# Altium project PCB_Project.PrjPcb
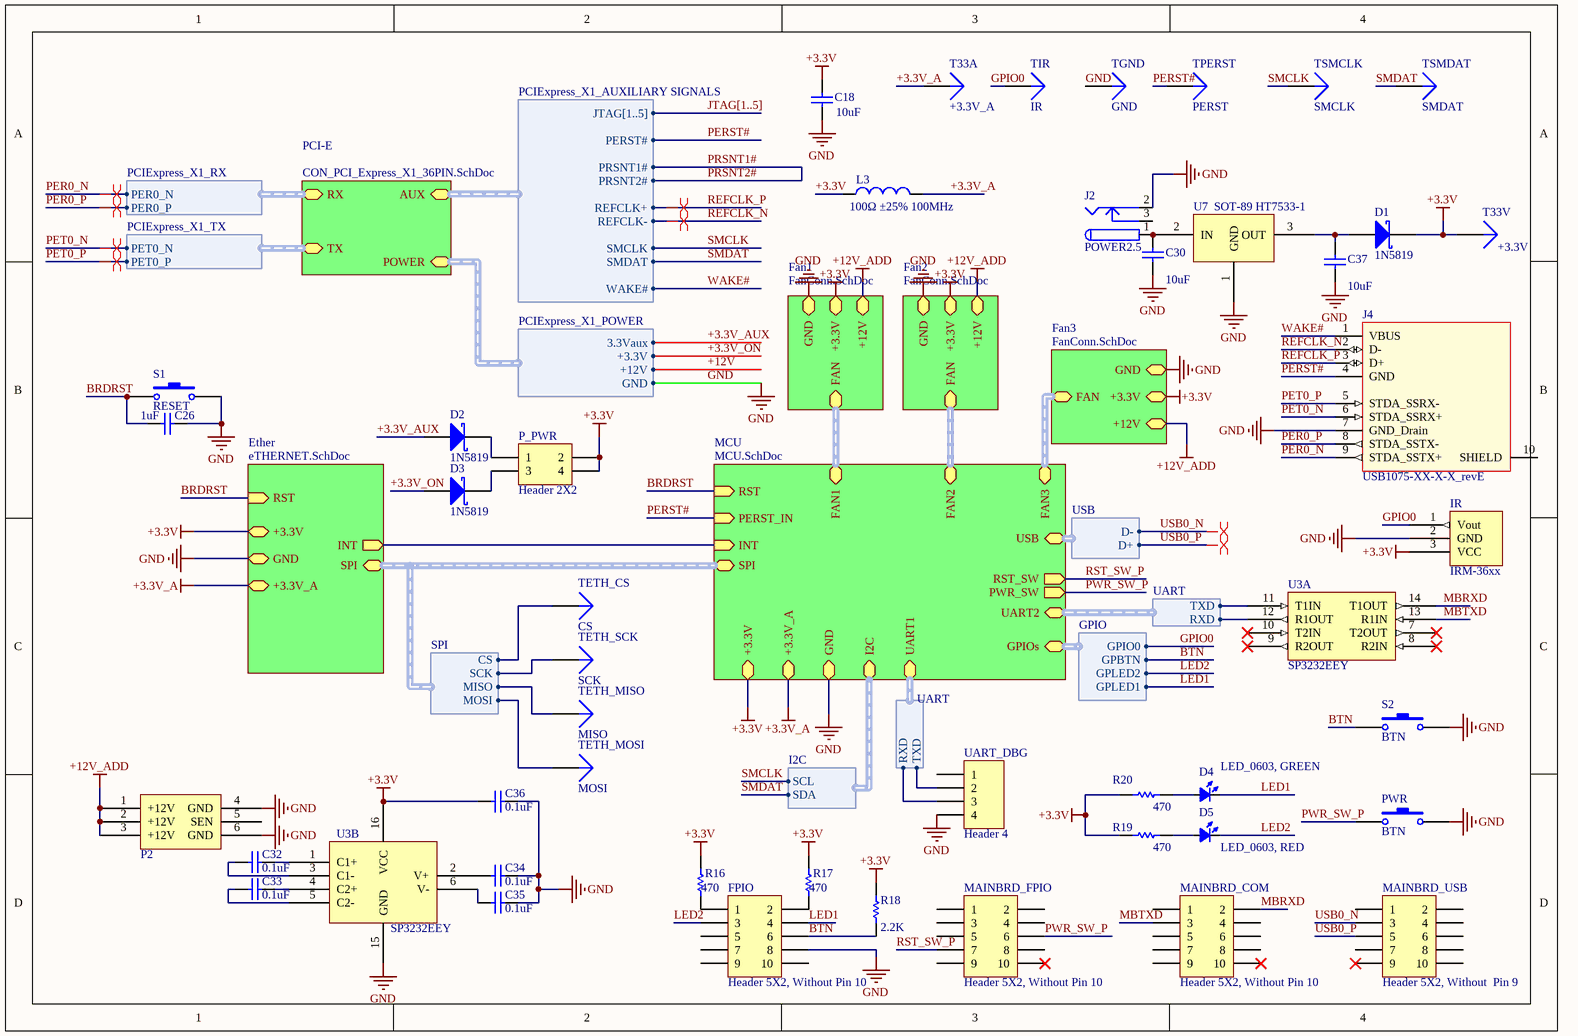
[diagram p0: PCI Express_16765X6890_36PIN_Half length.schdoc]
6 sheets, 108 parts. Net scope: strictly hierarchical (ports join the sheet entries above them; power ports are local).
Board file: PCI Express_16765X11115_36PIN_Half length.PCBDOC
Sheets:
  Sheet1.SchDoc
  PCI Express_16765X6890_36PIN_Half length.schdoc
    PCI-E = CON_PCI_Express_X1_36PIN.SchDoc
    Ether = eTHERNET.SchDoc
    MCU = MCU.SchDoc
    Fan1 = FanConn.SchDoc
    Fan2 = FanConn.SchDoc
    Fan3 = FanConn.SchDoc

## Sheet Sheet1.SchDoc
size A4

## Sheet PCI Express_16765X6890_36PIN_Half length.schdoc
size A4

### Parts
C18  value 10uF  [C-1608[0603]]
C26  value 1uF  [C-1608[0603]]  (hidden comment: Cap Semi)
C30  value 10uF  [C-1608[0603]]
C32  value 0.1uF  [C-1608[0603]]
C33  value 0.1uF  [C-1608[0603]]
C34  value 0.1uF  [C-1608[0603]]
C35  value 0.1uF  [C-1608[0603]]
C36  value 0.1uF  [C-1608[0603]]
C37  value 10uF  [C-1608[0603]]
D1  1N5819  [SOD123]
D2  1N5819  [SOD123]
D3  1N5819  [SOD123]
D4  LED_0603, GREEN  [LED_0603_GREEN]
D5  LED_0603, RED  [LED_0603_RED]
FPIO  Header 5X2, Without Pin 10  [HDR2X5-10]
IR  IRM-36xx  [IRM-36xx]
J2  POWER2.5  [DC_POWER]
J4  USB1075-XX-X-X_revE  [USB1075-XX-X-X_revE]
L3  value 100Ω ±25% 100MHz  [L-1608[0603]]
MAINBRD_COM  Header 5X2, Without Pin 10  [HDR2X5-10]
MAINBRD_FPIO  Header 5X2, Without Pin 10  [HDR2X5-10]
MAINBRD_USB  Header 5X2, Without  Pin 9  [HDR2X5-9]
P2  PCI-E Aux Power Connector 6Pin  [PCIE_AUX_PWR_CONN_6P]  (value not drawn)
P_PWR  Header 2X2  [HDR2X2]
PWR  BTN  [SW-SIDE]
R16  value 470  [R-1608[0603]]
R17  value 470  [R-1608[0603]]
R18  value 2.2K  [R-1608[0603]]
R19  value 470  [R-1608[0603]]
R20  value 470  [R-1608[0603]]
S1  RESET  [SW-2pin-SMD]
S2  BTN  [SW-SIDE]
T33A  +3.3V_A  [TESTPOINT]
T33V  +3.3V  [TESTPOINT]
TETH_CS  CS  [TESTPOINT]
TETH_MISO  MISO  [TESTPOINT]
TETH_MOSI  MOSI  [TESTPOINT]
TETH_SCK  SCK  [TESTPOINT]
TGND  GND  [TESTPOINT]
TIR  IR  [TESTPOINT]
TPERST  PERST  [TESTPOINT]
TSMCLK  SMCLK  [TESTPOINT]
TSMDAT  SMDAT  [TESTPOINT]
U3  SP3232EEY  [LC-TSSOP-16]  (parts A,B of 2)
U7  SOT-89 HT7533-1  [SOT89]
UART_DBG  Header 4  [HDR1X4]

### Sub-sheets
Ether = eTHERNET.SchDoc: +3.3V, GND, +3.3V_A, RST (in), INT (out), SPI (harness SPI)
Fan1 = FanConn.SchDoc: GND, +3.3V, FAN (harness FAN), +12V
Fan2 = FanConn.SchDoc: GND, +3.3V, FAN (harness FAN), +12V
Fan3 = FanConn.SchDoc: GND, +3.3V, FAN (harness FAN), +12V
MCU = MCU.SchDoc: RST (in), +3.3V, GND, SPI (harness SPI), UART1 (harness UART), INT (in), UART2 (harness UART), +3.3V_A, FAN2 (harness FAN), FAN1 (harness FAN), FAN3 (harness FAN), USB (harness USB), I2C (harness I2C), PERST_IN (in), PWR_SW (out), RST_SW (out), GPIOs (harness GPIO)
PCI-E = CON_PCI_Express_X1_36PIN.SchDoc: TX (harness PCIExpress_X1_TX), AUX (harness PCIExpress_X1_AUXILIARY SIGNALS), POWER (harness PCIExpress_X1_POWER), RX (harness PCIExpress_X1_RX)

### Harnesses
PCIExpress_X1_RX: PER0_N, PER0_P
PCIExpress_X1_TX: PET0_N, PET0_P
PCIExpress_X1_POWER: +3.3V, +12V, GND, 3.3Vaux
PCIExpress_X1_AUXILIARY SIGNALS: JTAG[1..5], PERST#, PRSNT1#, PRSNT2#, REFCLK+, REFCLK-, SMCLK, SMDAT, WAKE#
I2C: SCL, SDA
GPIO: GPLED1, GPLED2, GPBTN, GPIO0
USB: D+, D-
UART: TXD, RXD
SPI: MOSI, MISO, SCK, CS

### Nets
+3.3V: C18.2 C36.2 D1.2(K) IR.3(VCC) L3.1 P_PWR.2 P_PWR.4 R16.2 R17.2 R18.2 R19.2 R20.2 T33V.1 U3.16(VCC) ; sheet Ether/+3.3V, sheet MCU/+3.3V, sheet Fan1/+3.3V, sheet Fan2/+3.3V, sheet Fan3/+3.3V
+3.3V_A: L3.2 T33A.1 ; sheet Ether/+3.3V_A, sheet MCU/+3.3V_A
+12V_ADD: P2.1(+12V) P2.2(+12V) P2.3(+12V) ; sheet Fan1/+12V, sheet Fan2/+12V, sheet Fan3/+12V  [project net +12V]
GND: C18.1 C26.2 C30.1 C34.1 C35.1 C36.1 C37.1 FPIO.8 IR.2(GND) J2.2 J4.7(GND_Drain) P2.4(GND) P2.6(GND) PWR.2 S1.2 S2.2 TGND.1 U3.15(GND) U7.1(GND) UART_DBG.4 ; sheet Ether/GND, sheet MCU/GND, sheet Fan1/GND, sheet Fan2/GND, sheet Fan3/GND, sheet PCI-E/POWER.GND
+3.3V_AUX: D2.1(A) ; sheet PCI-E/POWER.3.3Vaux
+3.3V_ON: D3.1(A) ; sheet PCI-E/POWER.+3.3V
BRDRST: C26.1 S1.1 ; sheet Ether/RST, sheet MCU/RST
BTN: FPIO.6 R18.1 S2.1 ; sheet MCU/GPIOs.GPBTN
ETH_INT: sheet Ether/INT, sheet MCU/INT
ETH_MISO: TETH_MISO.1 ; sheet Ether/SPI.MISO
ETH_MOSI: TETH_MOSI.1 ; sheet Ether/SPI.MOSI
ETH_SCK: TETH_SCK.1 ; sheet Ether/SPI.SCK
ETH_SCS: TETH_CS.1 ; sheet Ether/SPI.CS
GPIO0: IR.1(Vout) TIR.1 ; sheet MCU/GPIOs.GPIO0
LED1: D4.2(K) FPIO.4 ; sheet MCU/GPIOs.GPLED1  [project net LED+]
LED2: D5.2(K) FPIO.3 ; sheet MCU/GPIOs.GPLED2  [project net LED-]
MBRXD: MAINBRD_COM.2 U3.14(T1OUT)
MBTXD: MAINBRD_COM.3 U3.13(R1IN)
PER0_N: J4.9(STDA_SSTX+) ; sheet PCI-E/RX.PER0_N
PER0_P: J4.8(STDA_SSTX-) ; sheet PCI-E/RX.PER0_P
PERST#: J4.4(GND) TPERST.1 ; sheet MCU/PERST_IN, sheet PCI-E/AUX.PERST#  [project net PERST]
PET0_N: J4.6(STDA_SSRX+) ; sheet PCI-E/TX.PET0_N
PET0_P: J4.5(STDA_SSRX-) ; sheet PCI-E/TX.PET0_P
PRSNT1#: sheet PCI-E/AUX.PRSNT1#, sheet PCI-E/AUX.PRSNT2#  [also labelled PRSNT2#]
PWR_SW_P: MAINBRD_FPIO.6 PWR.1 ; sheet MCU/PWR_SW
REFCLK_N: J4.2(D-) ; sheet PCI-E/AUX.REFCLK-
REFCLK_P: J4.3(D+) ; sheet PCI-E/AUX.REFCLK+
RST_SW_P: MAINBRD_FPIO.7 ; sheet MCU/RST_SW
RXD1: UART_DBG.3 ; sheet MCU/UART1.RXD
RXD2: U3.12(R1OUT) ; sheet MCU/UART2.RXD
SMCLK: TSMCLK.1 ; sheet PCI-E/AUX.SMCLK, sheet MCU/I2C.SCL  [project net I2C_SCL]
SMDAT: TSMDAT.1 ; sheet PCI-E/AUX.SMDAT, sheet MCU/I2C.SDA  [project net I2C_SDA]
TXD1: UART_DBG.2 ; sheet MCU/UART1.TXD
TXD2: U3.11(T1IN) ; sheet MCU/UART2.TXD
USB0_N: MAINBRD_USB.3 ; sheet MCU/USB.D-
USB0_P: MAINBRD_USB.5 ; sheet MCU/USB.D+
WAKE#: J4.1(VBUS) ; sheet PCI-E/AUX.WAKE#
NetC30_2: C30.2 J2.1 U7.2(IN)
NetC32_1: C32.1 U3.1(C1+)
NetC32_2: C32.2 U3.3(C1-)
NetC33_1: C33.1 U3.4(C2+)
NetC33_2: C33.2 U3.5(C2-)
NetC34_2: C34.2 U3.2(V+)
NetC35_2: C35.2 U3.6(V-)
NetC37_2: C37.2 D1.1(A) U7.3(OUT)
NetD2_2: D2.2(K) P_PWR.1
NetD3_2: D3.2(K) P_PWR.3
NetD4_1: D4.1(A) R20.1
NetD5_1: D5.1(A) R19.1
NetFPIO_1: FPIO.1 R16.1
NetFPIO_2: FPIO.2 R17.1

Not connected (* = marked no-connect by the designer): FPIO 5 7 9 10; J2 3; J4 10(SHIELD); MAINBRD_COM 1 4 5 6 7 8 9 10*; MAINBRD_FPIO 1 2 3 4 5 8 9 10*; MAINBRD_USB 1 2 4 6 7 8 9* 10; P2 5(SEN); U3 7(T2OUT)* 8(R2IN)* 9(R2OUT)* 10(T2IN)*; UART_DBG 1

### Buses and harness runs
bus JTAG[1..5]
harness sheet Ether/SPI = sheet MCU/SPI
harness sheet Fan1/FAN = sheet MCU/FAN1
harness sheet Fan2/FAN = sheet MCU/FAN2
harness sheet Fan3/FAN = sheet MCU/FAN3

### Layout directives
differential pair: PER0_N, PER0_P, PET0_N, PET0_P, REFCLK_N, REFCLK_P, USB0_N, USB0_P

### Notes on the sheet
- Title
- Size:
- Date:
- A4
- Number:
- Time:
- Revision:
- Sheet
- of
- File:

### Library data of the parts
C18 C26 C30 C32-C37 = Cap Semi: Capacitor (Semiconductor SIM Model); Published: 8-Jun-2000; LatestRevisionDate: 29-May-2009; LatestRevisionNote: IPC-7351 Footprint Added.; PackageReference: C1206; Publisher: Altium Limited; PackageDescription: Chip Capacitor
D1-D3 = D Schottky: Schottky Diode; Published: 8-Jun-2000; LatestRevisionDate: 17-Jul-2002; LatestRevisionNote: Re-released for DXP Platform.; PackageReference: SMB; Publisher: Altium Limited; PackageDescription: DO-214-AA/SMB; 2 C-Bend Leads; Body 5.3 x 3.6 mm, inc. leads (LxW); Code_JEDEC: DO-214-AA
D4 D5 = LED_0603: LED
FPIO MAINBRD_COM MAINBRD_FPIO MAINBRD_USB = Header 5X2: Header, 5-Pin, Dual row; LatestRevisionDate: 17-Jul-2002; LatestRevisionNote: Re-released for DXP Platform.; Publisher: Altium Limited
J4 = USB1075-XX-X-X_revE: USB 3.0 Receptecal, Type A, 9 Pin, Through Hole, Horizontal, Top Mount, with Kinked Shell Stakes
L3 = Inductor: Code_IEC: 1005; Published: 8-Jun-2000; LatestRevisionDate: 29-May-2009; LatestRevisionNote: IPC-7351 Footprint Added.; PackageReference: 0402-A; Publisher: Altium Limited; PackageDescription: Chip Inductor; Code_JEITA: 0402
P_PWR = Header 2X2: Header, 2-Pin, Dual row; LatestRevisionDate: 17-Jul-2002; LatestRevisionNote: Re-released for DXP Platform.; Publisher: Altium Limited
PWR S1 S2 = SW-PB: Switch; Published: 24-Mar-1999; LatestRevisionDate: 17-Jul-2002; LatestRevisionNote: Re-released for DXP Platform.; PackageReference: SPST-2; Publisher: Altium Limited
R16-R20 = Res Semi: Semiconductor Resistor; Published: 8-Jun-2000; LatestRevisionDate: 17-Jul-2002; LatestRevisionNote: Re-released for DXP Platform.; PackageReference: AXIAL-0.5; Publisher: Altium Limited; PackageDescription: Axial Device, Thru-Hole; 2 Leads; 0.5 in Pin Spacing
T33A T33V TETH_CS TETH_MISO TETH_MOSI TETH_SCK TGND TIR TPERST TSMCLK TSMDAT = Plug: LatestRevisionDate: 17-Jul-2002; LatestRevisionNote: Re-released for DXP Platform.; Publisher: Altium Limited
U7 = HT73XX: Low Power Consumption LDO
UART_DBG = Header 4: Header, 4-Pin; LatestRevisionDate: 17-Jul-2002; LatestRevisionNote: Re-released for DXP Platform.; Publisher: Altium Limited

## Sheet CON_PCI_Express_X1_36PIN.SchDoc: PCI Express x1 36Pin
size A4
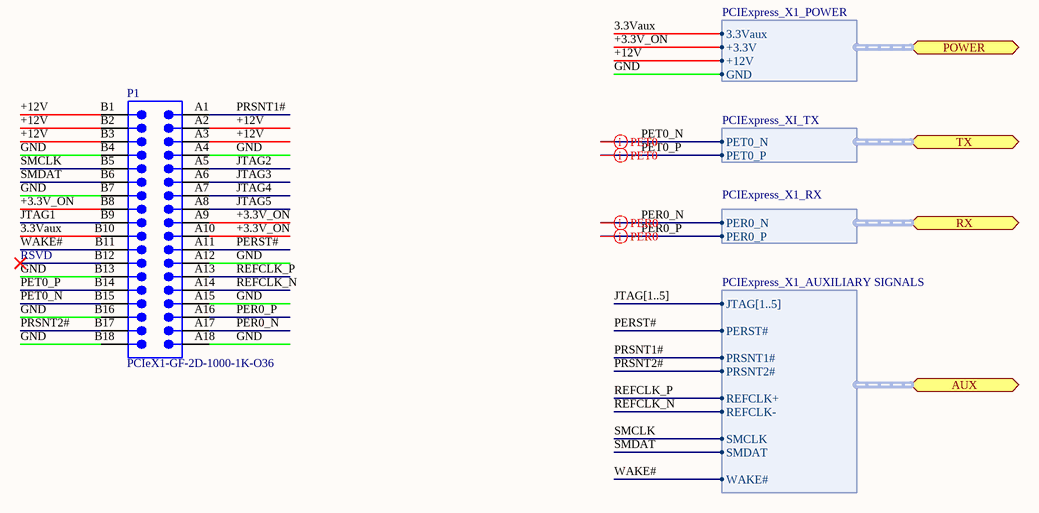
[diagram p1: CON_PCI_Express_X1_36PIN.SchDoc]

### Parts
P1  PCIeX1-GF-2D-1000-1K-O36  [PCIeX1-GF-2D-1000-1K-O36]  (no BOM)

### Ports
AUX (harness PCIExpress_X1_AUXILIARY SIGNALS), POWER (harness PCIExpress_X1_POWER), RX (harness PCIExpress_X1_RX), TX (harness PCIExpress_XI_TX)

### Harnesses
PCIExpress_X1_RX: PER0_N, PER0_P
PCIExpress_XI_TX: PET0_N, PET0_P
PCIExpress_X1_POWER: +3.3V, +12V, GND, 3.3Vaux
PCIExpress_X1_AUXILIARY SIGNALS: JTAG[1..5], PERST#, PRSNT1#, PRSNT2#, REFCLK+, REFCLK-, SMCLK, SMDAT, WAKE#

### Nets
GND: P1.A4 P1.A12 P1.A15 P1.A18 P1.B4 P1.B7 P1.B13 P1.B16 P1.B18 ; port POWER.GND
3.3Vaux: P1.B10 ; port POWER.3.3Vaux  [project net +3.3V_AUX]
+3.3V_ON: P1.A9 P1.A10 P1.B8 ; port POWER.+3.3V
+12V: P1.A2 P1.A3 P1.B1 P1.B2 P1.B3 ; port POWER.+12V
JTAG1: P1.B9
JTAG2: P1.A5
JTAG3: P1.A6
JTAG4: P1.A7
JTAG5: P1.A8
PER0_N: P1.A17 ; port RX.PER0_N
PER0_P: P1.A16 ; port RX.PER0_P
PERST#: P1.A11 ; port AUX.PERST#  [project net PERST]
PET0_N: P1.B15 ; port TX.PET0_N
PET0_P: P1.B14 ; port TX.PET0_P
PRSNT1#: P1.A1 P1.B17 ; port AUX.PRSNT1#, port AUX.PRSNT2#  [also labelled PRSNT2#]
REFCLK_N: P1.A14 ; port AUX.REFCLK-
REFCLK_P: P1.A13 ; port AUX.REFCLK+
SMCLK: P1.B5 ; port AUX.SMCLK  [project net I2C_SCL]
SMDAT: P1.B6 ; port AUX.SMDAT  [project net I2C_SDA]
WAKE#: P1.B11 ; port AUX.WAKE#

Not connected (* = marked no-connect by the designer): P1 B12*

### Buses and harness runs
bus JTAG[1..5]

### Layout directives
differential pair: PER0_N, PER0_P, PET0_N, PET0_P

### Notes on the sheet
- RSVD
- Sheet Title
- Project Title
- Size:
- Date:
- A4
- Item:
- Time:
- Revision:
- Sheet
- of
- File:

### Library data of the parts
P1 = CMP-0001-00030-2: Golden finger, PCIeX1, Dual, Opposite, Pitch 1mm, 36-Position; Mating Connector: Molex-87715-9006; Package Reference: PCIeX1-GF-2D-1000-1K-O36; ClassName: Edge Connector; Publisher: Altium; Datasheet Version: rev2.0, Apr-2007

## Sheet eTHERNET.SchDoc
size A4
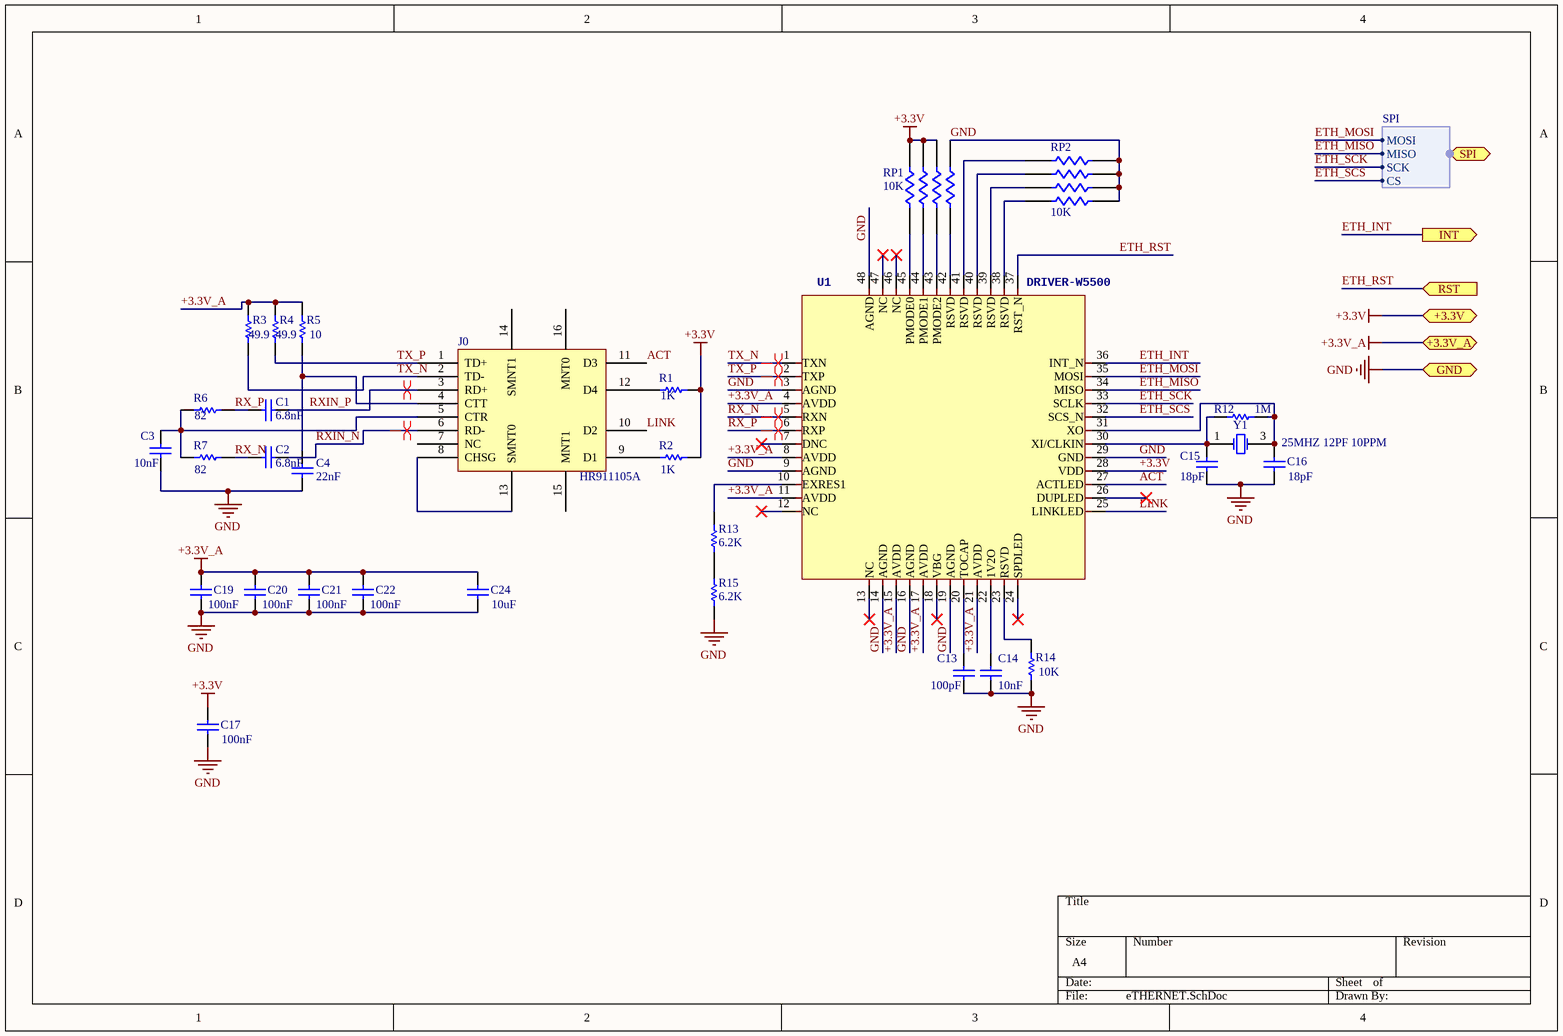
[diagram p2: eTHERNET.SchDoc]

### Parts
C1  value 6.8nF  [C-1608[0603]]
C2  value 6.8nF  [C-1608[0603]]
C3  value 10nF  [C-1608[0603]]
C4  value 22nF  [C-1608[0603]]
C13  value 100pF  [C-1608[0603]]
C14  value 10nF  [C-1608[0603]]
C15  value 18pF  [C-1608[0603]]
C16  value 18pF  [C-1608[0603]]
C17  value 100nF  [C-1608[0603]]
C19  value 100nF  [C-1608[0603]]
C20  value 100nF  [C-1608[0603]]
C21  value 100nF  [C-1608[0603]]
C22  value 100nF  [C-1608[0603]]
C24  value 10uF  [C-1608[0603]]
J0  HR911105A  [RJ45-8P8C]
R1  value 1K  [R-1608[0603]]
R2  value 1K  [R-1608[0603]]
R3  value 49.9  [R-1608[0603]]
R4  value 49.9  [R-1608[0603]]
R5  value 10  [R-1608[0603]]
R6  value 82  [R-1608[0603]]
R7  value 82  [R-1608[0603]]
R12  value 1M  [R-1608[0603]]
R13  value 6.2K  [R-1608[0603]]
R14  value 10K  [R-1608[0603]]
R15  value 6.2K  [R-1608[0603]]
RP1  10K  [R0603x4]
RP2  10K  [R0603x4]
U1  DRIVER-W5500  [TQFP48_N]
Y1  25MHZ 12PF 10PPM  [XT_3225_4]

### Ports
+3.3V, +3.3V_A, GND, INT (out), RST (in), SPI (harness SPI)

### Harnesses
SPI: MOSI, MISO, SCK, CS

### Nets
+3.3V: C17.2 R1.2 R2.2 RP1.6 RP1.7 RP1.8 U1.28(VDD) ; port +3.3V
+3.3V_A: C19.2 C20.2 C21.2 C22.2 C24.2 R3.2 R4.2 R5.2 U1.4(AVDD) U1.8(AVDD) U1.11(AVDD) U1.15(AVDD) U1.17(AVDD) U1.21(AVDD) ; port +3.3V_A
GND: C3.1 C4.1 C13.1 C14.1 C15.1 C16.1 C17.1 C19.1 C20.1 C21.1 C22.1 C24.1 R14.2 R15.2 RP1.5 RP2.5 RP2.6 RP2.7 RP2.8 U1.3(AGND) U1.9(AGND) U1.14(AGND) U1.16(AGND) U1.19(AGND) U1.29(GND) U1.48(AGND) ; port GND
ACT: J0.11(D3) U1.27(ACTLED)
ETH_INT: U1.36(INT_N) ; port INT
ETH_MISO: U1.34(MISO) ; port SPI.MISO
ETH_MOSI: U1.35(MOSI) ; port SPI.MOSI
ETH_RST: U1.37(RST_N) ; port RST  [project net BRDRST]
ETH_SCK: U1.33(SCLK) ; port SPI.SCK
ETH_SCS: U1.32(SCS_N) ; port SPI.CS
LINK: J0.10(D2) U1.25(LINKLED)
RX_N: C2.1 R7.2 U1.5(RXN)
RX_P: C1.1 R6.2 U1.6(RXP)
RXIN_N: C2.2 J0.6(RD-)
RXIN_P: C1.2 J0.3(RD+)
TX_N: J0.2(TD-) R3.1 U1.1(TXN)
TX_P: J0.1(TD+) R4.1 U1.2(TXP)
NetC3_2: C3.2 J0.5(CTR) R6.1 R7.1
NetC4_2: C4.2 J0.4(CTT) R5.1
NetC13_2: C13.2 U1.20(TOCAP)
NetC14_2: C14.2 U1.22(1V2O)
NetC15_2: C15.2 R12.1 U1.30(XI/CLKIN) Y1.1(OSC1)
NetC16_2: C16.2 R12.2 U1.31(XO) Y1.3(OSC2)
NetJ0_8: J0.8(CHSG) J0.13(SMNT0)
NetJ0_9: J0.9(D1) R2.1
NetJ0_12: J0.12(D4) R1.1
NetR13_1: R13.1 U1.10(EXRES1)
NetR13_2: R13.2 R15.1
NetR14_1: R14.1 U1.23(RSVD)
NetRP1_1: RP1.1 U1.45(PMODE0)
NetRP1_2: RP1.2 U1.44(PMODE1)
NetRP1_3: RP1.3 U1.43(PMODE2)
NetRP1_4: RP1.4 U1.42(RSVD)
NetRP2_1: RP2.1 U1.41(RSVD)
NetRP2_2: RP2.2 U1.40(RSVD)
NetRP2_3: RP2.3 U1.39(RSVD)
NetRP2_4: RP2.4 U1.38(RSVD)

Not connected (* = marked no-connect by the designer): J0 7(NC) 14(SMNT1) 15(MNT1) 16(MNT0); U1 7(DNC)* 12(NC)* 13(NC)* 18(VBG)* 24(SPDLED)* 26(DUPLED)* 46(NC)* 47(NC)*

### Layout directives
differential pair: RX_N, RX_P, RXIN_N, RXIN_P, TX_N, TX_P

### Library data of the parts
C1-C4 C13-C17 C19-C22 C24 = Cap Semi: Capacitor (Semiconductor SIM Model); Published: 8-Jun-2000; LatestRevisionDate: 29-May-2009; LatestRevisionNote: IPC-7351 Footprint Added.; Publisher: Altium Limited; PackageDescription: Chip Capacitor
  C1-C4 C14-C17 C19-C22 C24: PackageReference: C1206
  C13: PackageReference: 4.7uF
J0 = RJ45INTLED
R1-R7 R12-R15 = Res Semi: Semiconductor Resistor; Published: 8-Jun-2000; LatestRevisionDate: 17-Jul-2002; LatestRevisionNote: Re-released for DXP Platform.; PackageReference: AXIAL-0.5; Publisher: Altium Limited
  R1-R7 R12 R14: PackageDescription: Axial Device, Thru-Hole; 2 Leads; 0.5 in Pin Spacing
RP1 RP2 = RPACK4
Y1 = XTAL: Crystal Oscillator; Published: 8-Jun-2000; LatestRevisionDate: 17-Jul-2002; LatestRevisionNote: Re-released for DXP Platform.; PackageReference: R38; Publisher: Altium Limited; PackageDescription: Crystal, Thru-Hole; 2 Leads; Body 3.1 x 8.2 mm (Dia.xH)

## Sheet MCU.SchDoc
size A4
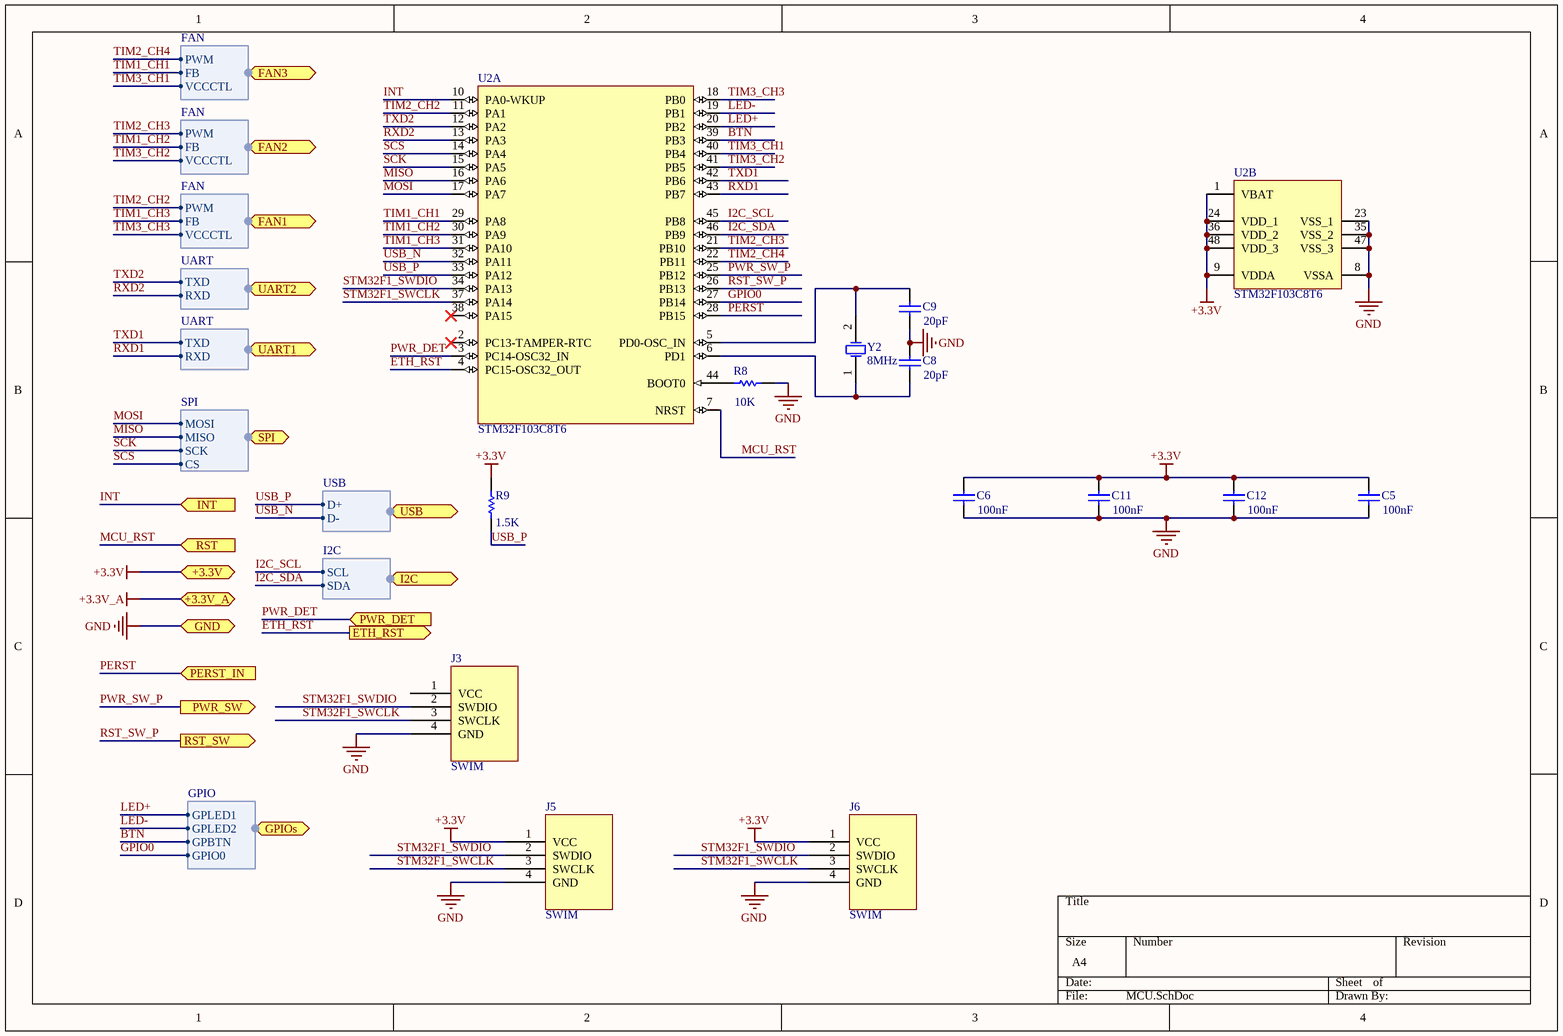
[diagram p3: MCU.SchDoc]

### Parts
C5  value 100nF  [C-1608[0603]]
C6  value 100nF  [C-1608[0603]]
C8  value 20pF  [C-1608[0603]]
C9  value 20pF  [C-1608[0603]]
C11  value 100nF  [C-1608[0603]]
C12  value 100nF  [C-1608[0603]]
J3  SWIM  [SIP4]
J5  SWIM  [SWD_SOCKET]
J6  SWIM  [SWD_HEADER]
R8  value 10K  [R-1608[0603]]
R9  value 1.5K  [R-1608[0603]]
U2  STM32F103C8T6  [TQFP48_N]  (parts A,B of 2)
Y2  8MHz  [LC-SMD-5032_2P]

### Ports
+3.3V, +3.3V_A, ETH_RST (out), FAN1 (harness FAN), FAN2 (harness FAN), FAN3 (harness FAN), GND, GPIOs (harness GPIO), I2C (harness I2C), INT (in), PERST_IN (in), PWR_DET (in), PWR_SW (out), RST (in), RST_SW (out), SPI (harness SPI), UART1 (harness UART), UART2 (harness UART), USB (harness USB)

### Harnesses
SPI: MOSI, MISO, SCK, CS
UART: TXD, RXD
USB: D+, D-
I2C: SCL, SDA
GPIO: GPLED1, GPLED2, GPBTN, GPIO0
FAN: PWM, FB, VCCCTL

### Nets
+3.3V: C5.2 C6.2 C11.2 C12.2 J5.1(VCC) J6.1(VCC) R9.2 U2.1(VBAT) U2.9(VDDA) U2.24(VDD_1) U2.36(VDD_2) U2.48(VDD_3) ; port +3.3V
GND: C5.1 C6.1 C8.2 C9.1 C11.1 C12.1 J3.4(GND) J5.4(GND) J6.4(GND) R8.2 U2.8(VSSA) U2.23(VSS_1) U2.35(VSS_2) U2.47(VSS_3) ; port GND
BTN: U2.39(PB3) ; port GPIOs.GPBTN
ETH_RST: U2.4(PC15-OSC32_OUT) ; port ETH_RST
GPIO0: U2.27(PB14) ; port GPIOs.GPIO0
I2C_SCL: U2.45(PB8) ; port I2C.SCL
I2C_SDA: U2.46(PB9) ; port I2C.SDA
INT: U2.10(PA0-WKUP) ; port INT  [project net ETH_INT]
LED+: U2.20(PB2) ; port GPIOs.GPLED1
LED-: U2.19(PB1) ; port GPIOs.GPLED2
MCU_RST: U2.7(NRST) ; port RST  [project net BRDRST]
MISO: U2.16(PA6) ; port SPI.MISO  [project net ETH_MISO]
MOSI: U2.17(PA7) ; port SPI.MOSI  [project net ETH_MOSI]
PERST: U2.28(PB15) ; port PERST_IN
PWR_DET: U2.3(PC14-OSC32_IN) ; port PWR_DET
PWR_SW_P: U2.25(PB12) ; port PWR_SW
RST_SW_P: U2.26(PB13) ; port RST_SW
RXD1: U2.43(PB7) ; port UART1.RXD
RXD2: U2.13(PA3) ; port UART2.RXD
SCK: U2.15(PA5) ; port SPI.SCK  [project net ETH_SCK]
SCS: U2.14(PA4) ; port SPI.CS  [project net ETH_SCS]
STM32F1_SWCLK: J3.3(SWCLK) J5.3(SWCLK) J6.3(SWCLK) U2.37(PA14)
STM32F1_SWDIO: J3.2(SWDIO) J5.2(SWDIO) J6.2(SWDIO) U2.34(PA13)
TIM1_CH1: U2.29(PA8) ; port FAN3.FB  [project net SEN]
TIM1_CH2: U2.30(PA9) ; port FAN2.FB  [project net SEN]
TIM1_CH3: U2.31(PA10) ; port FAN1.FB  [project net SEN]
TIM2_CH2: U2.11(PA1) ; port FAN1.PWM  [project net PWM]
TIM2_CH3: U2.21(PB10) ; port FAN2.PWM  [project net PWM]
TIM2_CH4: U2.22(PB11) ; port FAN3.PWM  [project net PWM]
TIM3_CH1: U2.40(PB4) ; port FAN3.VCCCTL
TIM3_CH2: U2.41(PB5) ; port FAN2.VCCCTL
TIM3_CH3: U2.18(PB0) ; port FAN1.VCCCTL
TXD1: U2.42(PB6) ; port UART1.TXD
TXD2: U2.12(PA2) ; port UART2.TXD
USB_N: U2.32(PA11) ; port USB.D-  [project net USB0_N]
USB_P: R9.1 U2.33(PA12) ; port USB.D+  [project net USB0_P]
NetC8_1: C8.1 U2.6(PD1) Y2.1(OSC1)
NetC9_2: C9.2 U2.5(PD0-OSC_IN) Y2.2(OSC2)
NetR8_1: R8.1 U2.44(BOOT0)

Not connected (* = marked no-connect by the designer): J3 1(VCC); U2 2(PC13-TAMPER-RTC)* 38(PA15)*

### Library data of the parts
C5 C6 C8 C9 C11 C12 = Cap Semi: Capacitor (Semiconductor SIM Model); Published: 8-Jun-2000; LatestRevisionDate: 29-May-2009; LatestRevisionNote: IPC-7351 Footprint Added.; PackageReference: C1206; Publisher: Altium Limited; PackageDescription: Chip Capacitor
J3 J5 J6 = SWD
R8 R9 = Res Semi: Semiconductor Resistor; Published: 8-Jun-2000; LatestRevisionDate: 17-Jul-2002; LatestRevisionNote: Re-released for DXP Platform.; PackageReference: AXIAL-0.5; Publisher: Altium Limited; PackageDescription: Axial Device, Thru-Hole; 2 Leads; 0.5 in Pin Spacing
U2 = STM32F103C8T6: ARM; ComponentLink1Description: 供应商链接; ComponentLink1URL: http://www.szlcsc.com/product/details_9243.html; Package: LQFP-48_7x7x05P; Supplier: LC; SuppliersPartNumber: C8734
Y2 = XTAL: Crystal Oscillator; Published: 8-Jun-2000; LatestRevisionDate: 17-Jul-2002; LatestRevisionNote: Re-released for DXP Platform.; PackageReference: R38; Publisher: Altium Limited; PackageDescription: Crystal, Thru-Hole; 2 Leads; Body 3.1 x 8.2 mm (Dia.xH)

## Sheet FanConn.SchDoc
size A4
Used 3 times, as channels Fan1, Fan2, Fan3. Parts and nets are listed once, with the designators drawn on the sheet.
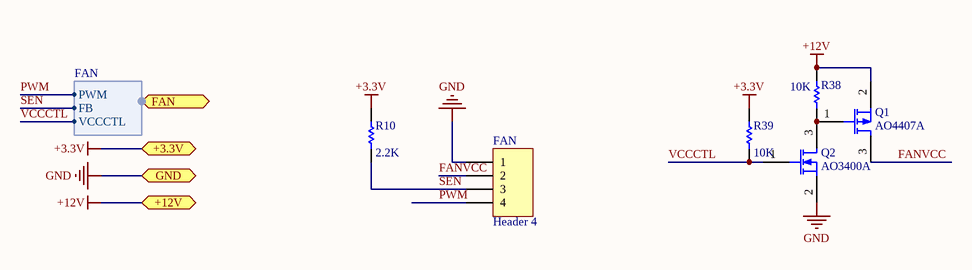
[diagram p4: FanConn.SchDoc]

### Parts
FAN  Header 4  [FAN_CONN-4P]
Q1  AO4407A  [SOP8-MOS]
Q2  AO3400A  [SOT23B]
R10  value 2.2K  [R-1608[0603]]
R38  value 10K  [R-1608[0603]]
R39  value 10K  [R-1608[0603]]

### Ports
+3.3V, +12V, FAN (harness FAN), GND

### Harnesses
FAN: PWM, FB, VCCCTL

### Nets
+3.3V: R10.2 R39.1 ; port +3.3V
+12V: Q1.2(S) R38.1 ; port +12V
GND: FAN.1 Q2.2(S) ; port GND
FANVCC: FAN.2 Q1.3(D)
PWM: FAN.4 ; port FAN.PWM
SEN: FAN.3 R10.1 ; port FAN.FB
VCCCTL: Q2.1(G) R39.2 ; port FAN.VCCCTL
NetQ1_1: Q1.1(G) Q2.3(D) R38.2

### Channels
Fan1: designators end in A; ports +3.3V=+3.3V +12V=+12V GND=GND
Fan2: designators end in B; ports +3.3V=+3.3V +12V=+12V GND=GND
Fan3: designators end in C; ports +3.3V=+3.3V +12V=+12V GND=GND

### Library data of the parts
FAN = Header 4: Header, 4-Pin; LatestRevisionDate: 17-Jul-2002; LatestRevisionNote: Re-released for DXP Platform.; Publisher: Altium Limited
Q1 = SI2301: P-Channel MOSFET; pin to pad: 1>G 2>S 3>D; Published: 8-Jun-2000; LatestRevisionDate: 17-Jul-2002; LatestRevisionNote: Re-released for DXP Platform.; PackageVersion: 1995/1996; PackageReference: E3; Publisher: Altium Limited
Q2 = SI2302: N-Channel MOSFET; Published: 8-Jun-2000; LatestRevisionDate: 17-Jul-2002; LatestRevisionNote: Re-released for DXP Platform.; PackageVersion: 1995/1996; PackageReference: E3; Publisher: Altium Limited
R10 R38 R39 = Res Semi: Semiconductor Resistor; Published: 8-Jun-2000; LatestRevisionDate: 17-Jul-2002; LatestRevisionNote: Re-released for DXP Platform.; PackageReference: AXIAL-0.5; Publisher: Altium Limited; PackageDescription: Axial Device, Thru-Hole; 2 Leads; 0.5 in Pin Spacing

## Nets that join several sheets
+3.3V: PCI Express_16765X6890_36PIN_Half length (14 pins), eTHERNET (7 pins), MCU (12 pins), Fan1 (R10A.2 R39A.1), Fan2 (R10B.2 R39B.1), Fan3 (R10C.2 R39C.1)
+3.3V_A: PCI Express_16765X6890_36PIN_Half length (L3.2 T33A.1), eTHERNET (14 pins)
+12V: PCI Express_16765X6890_36PIN_Half length (P2.1 P2.2 P2.3), Fan1 (Q1A.2 R38A.1), Fan2 (Q1B.2 R38B.1), Fan3 (Q1C.2 R38C.1)
GND: PCI Express_16765X6890_36PIN_Half length (20 pins), CON_PCI_Express_X1_36PIN (9 pins), eTHERNET (26 pins), MCU (14 pins), Fan1 (FANA.1 Q2A.2), Fan2 (FANB.1 Q2B.2), Fan3 (FANC.1 Q2C.2)
+3.3V_AUX: PCI Express_16765X6890_36PIN_Half length (D2.1), CON_PCI_Express_X1_36PIN (P1.B10)
+3.3V_ON: PCI Express_16765X6890_36PIN_Half length (D3.1), CON_PCI_Express_X1_36PIN (P1.A9 P1.A10 P1.B8)
BRDRST: PCI Express_16765X6890_36PIN_Half length (C26.1 S1.1), eTHERNET (U1.37), MCU (U2.7)
BTN: PCI Express_16765X6890_36PIN_Half length (FPIO.6 R18.1 S2.1), MCU (U2.39)
ETH_INT: eTHERNET (U1.36), MCU (U2.10)
ETH_MISO: PCI Express_16765X6890_36PIN_Half length (TETH_MISO.1), eTHERNET (U1.34), MCU (U2.16)
ETH_MOSI: PCI Express_16765X6890_36PIN_Half length (TETH_MOSI.1), eTHERNET (U1.35), MCU (U2.17)
ETH_SCK: PCI Express_16765X6890_36PIN_Half length (TETH_SCK.1), eTHERNET (U1.33), MCU (U2.15)
ETH_SCS: PCI Express_16765X6890_36PIN_Half length (TETH_CS.1), eTHERNET (U1.32), MCU (U2.14)
GPIO0: PCI Express_16765X6890_36PIN_Half length (IR.1 TIR.1), MCU (U2.27)
I2C_SCL: PCI Express_16765X6890_36PIN_Half length (TSMCLK.1), CON_PCI_Express_X1_36PIN (P1.B5), MCU (U2.45)
I2C_SDA: PCI Express_16765X6890_36PIN_Half length (TSMDAT.1), CON_PCI_Express_X1_36PIN (P1.B6), MCU (U2.46)
LED+: PCI Express_16765X6890_36PIN_Half length (D4.2 FPIO.4), MCU (U2.20)
LED-: PCI Express_16765X6890_36PIN_Half length (D5.2 FPIO.3), MCU (U2.19)
PER0_N: PCI Express_16765X6890_36PIN_Half length (J4.9), CON_PCI_Express_X1_36PIN (P1.A17)
PER0_P: PCI Express_16765X6890_36PIN_Half length (J4.8), CON_PCI_Express_X1_36PIN (P1.A16)
PERST: PCI Express_16765X6890_36PIN_Half length (J4.4 TPERST.1), CON_PCI_Express_X1_36PIN (P1.A11), MCU (U2.28)
PET0_N: PCI Express_16765X6890_36PIN_Half length (J4.6), CON_PCI_Express_X1_36PIN (P1.B15)
PET0_P: PCI Express_16765X6890_36PIN_Half length (J4.5), CON_PCI_Express_X1_36PIN (P1.B14)
PWM: MCU (U2.11), Fan1 (FANA.4)
PWM: MCU (U2.21), Fan2 (FANB.4)
PWM: MCU (U2.22), Fan3 (FANC.4)
PWR_SW_P: PCI Express_16765X6890_36PIN_Half length (MAINBRD_FPIO.6 PWR.1), MCU (U2.25)
REFCLK_N: PCI Express_16765X6890_36PIN_Half length (J4.2), CON_PCI_Express_X1_36PIN (P1.A14)
REFCLK_P: PCI Express_16765X6890_36PIN_Half length (J4.3), CON_PCI_Express_X1_36PIN (P1.A13)
RST_SW_P: PCI Express_16765X6890_36PIN_Half length (MAINBRD_FPIO.7), MCU (U2.26)
RXD1: PCI Express_16765X6890_36PIN_Half length (UART_DBG.3), MCU (U2.43)
RXD2: PCI Express_16765X6890_36PIN_Half length (U3.12), MCU (U2.13)
SEN: MCU (U2.29), Fan3 (FANC.3 R10C.1)
SEN: MCU (U2.30), Fan2 (FANB.3 R10B.1)
SEN: MCU (U2.31), Fan1 (FANA.3 R10A.1)
TIM3_CH1: MCU (U2.40), Fan3 (Q2C.1 R39C.2)
TIM3_CH2: MCU (U2.41), Fan2 (Q2B.1 R39B.2)
TIM3_CH3: MCU (U2.18), Fan1 (Q2A.1 R39A.2)
TXD1: PCI Express_16765X6890_36PIN_Half length (UART_DBG.2), MCU (U2.42)
TXD2: PCI Express_16765X6890_36PIN_Half length (U3.11), MCU (U2.12)
USB0_N: PCI Express_16765X6890_36PIN_Half length (MAINBRD_USB.3), MCU (U2.32)
USB0_P: PCI Express_16765X6890_36PIN_Half length (MAINBRD_USB.5), MCU (R9.1 U2.33)
WAKE#: PCI Express_16765X6890_36PIN_Half length (J4.1), CON_PCI_Express_X1_36PIN (P1.B11)